# Altium schematic sheet PMIC.SchDoc
size Tabloid; DocumentNumber: 2; SheetNumber: 2; SheetTotal: 13
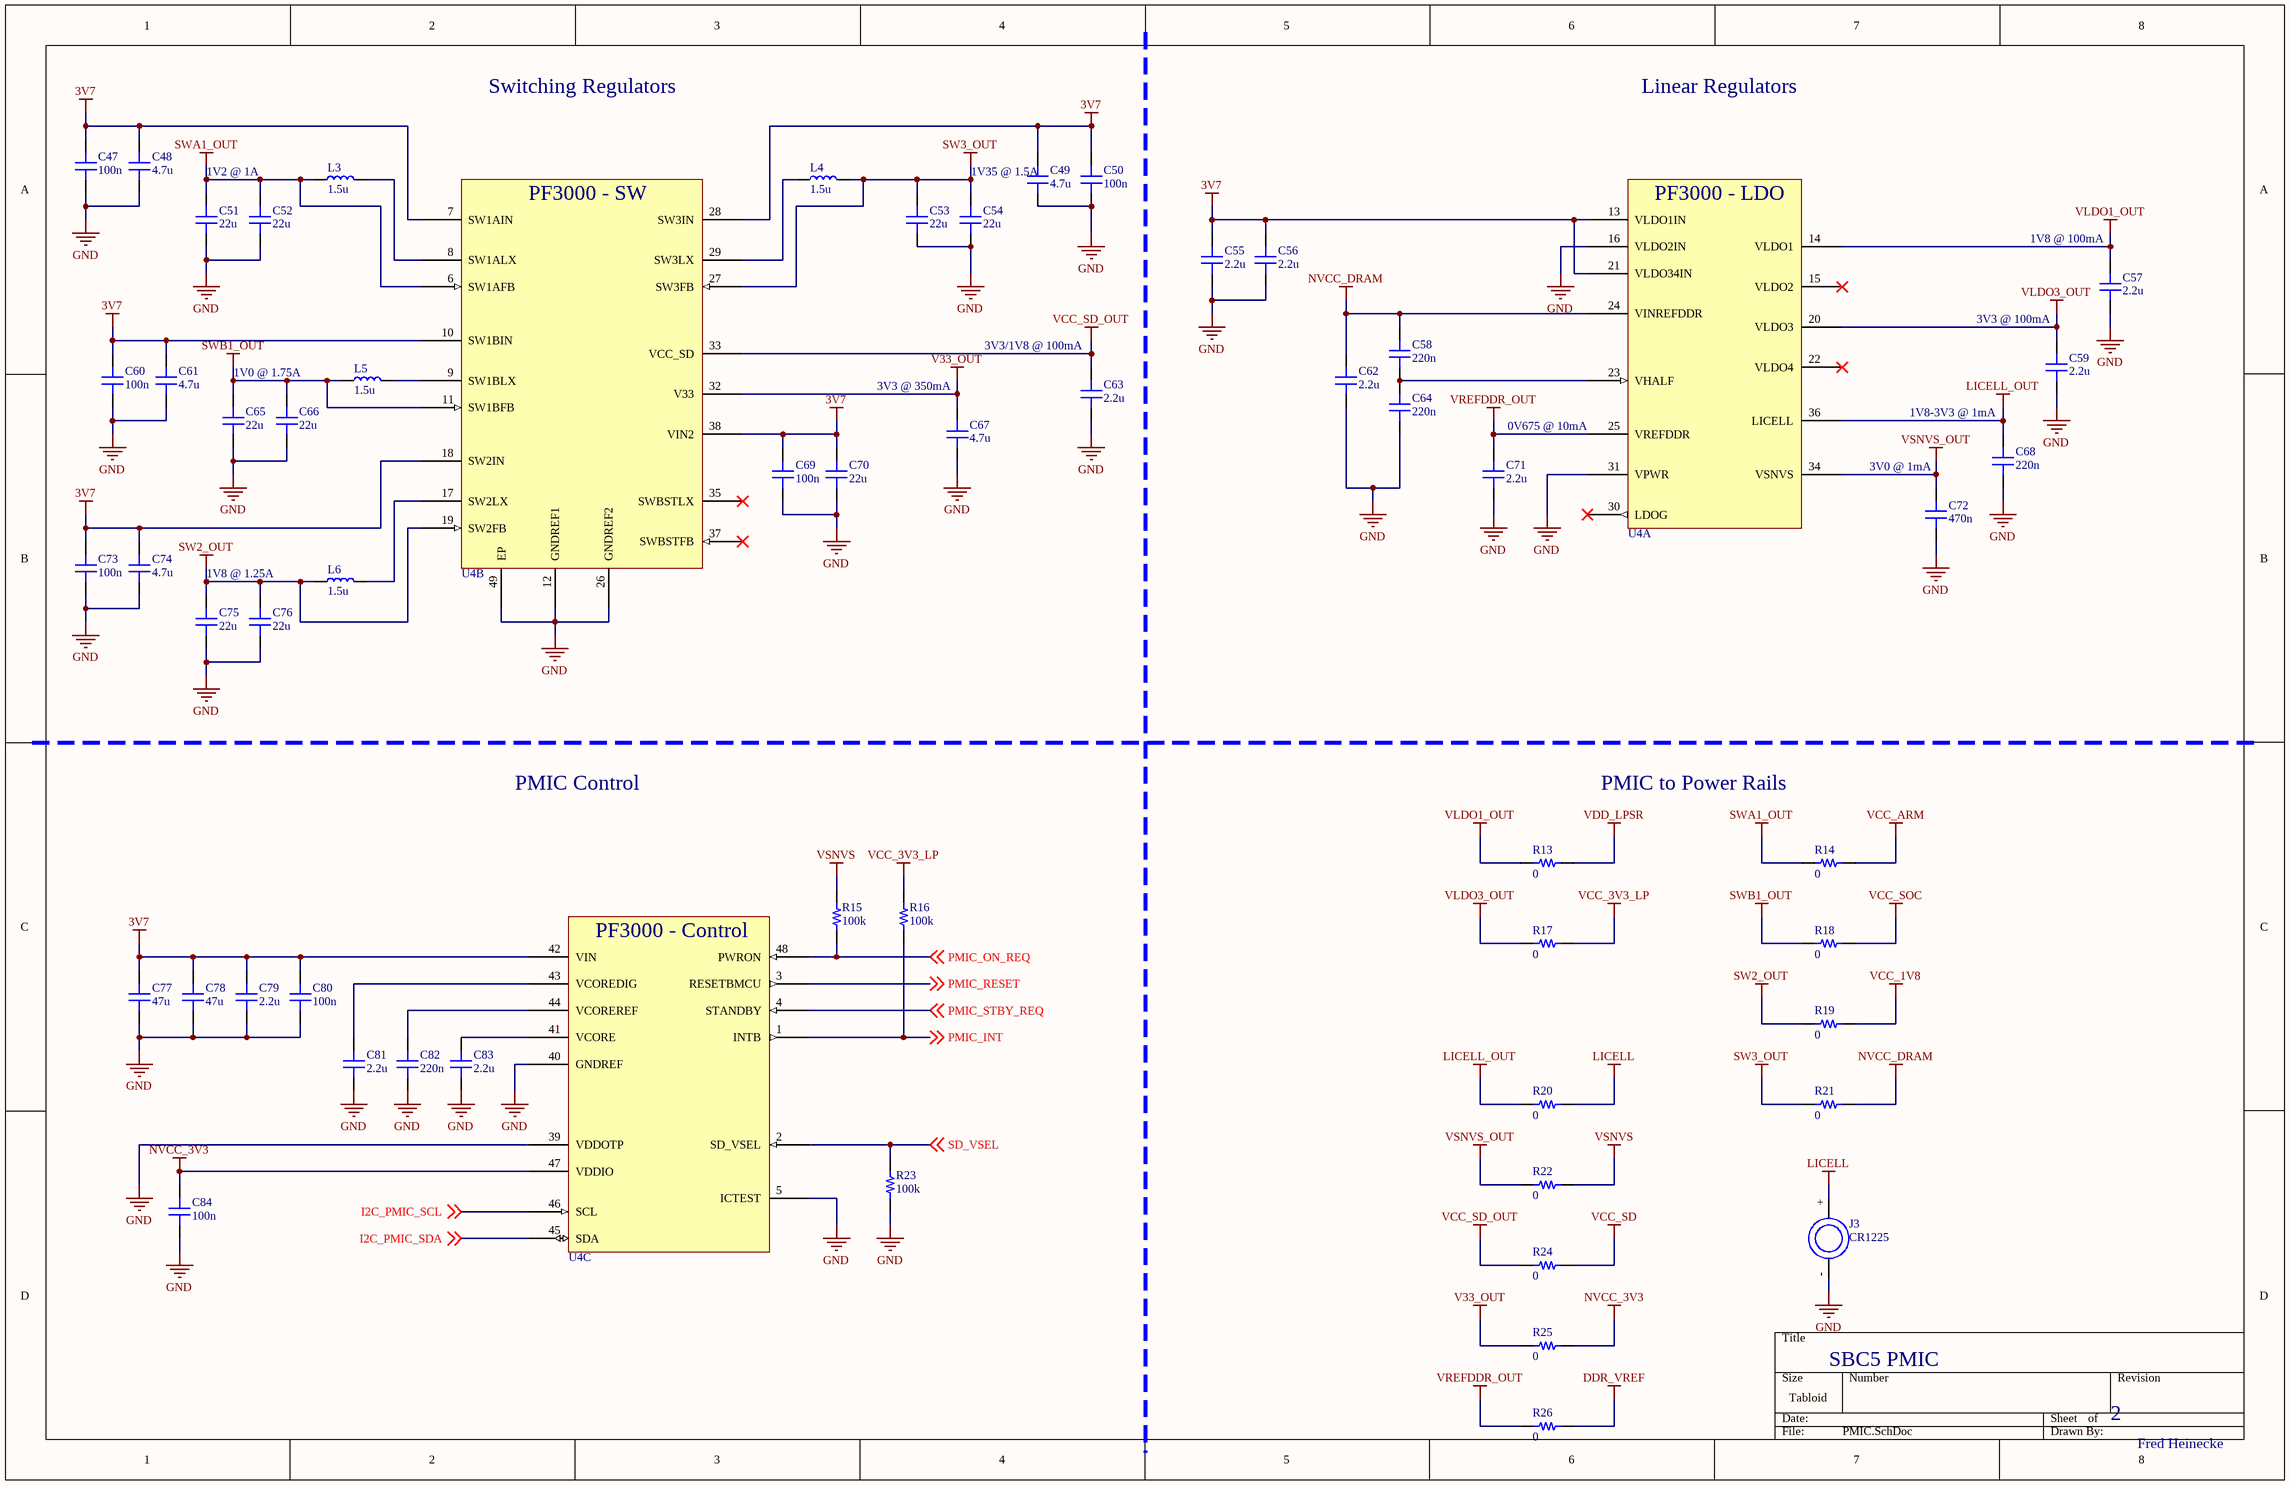
[diagram p0: PMIC.SchDoc]

## Parts
C47  100n  [C0201]
C48  4.7u  [C0603]
C49  4.7u  [C0603]
C50  100n  [C0201]
C51  22u  [C0603]
C52  22u  [C0603]
C53  22u  [C0603]
C54  22u  [C0603]
C55  2.2u  [C0402]
C56  2.2u  [C0402]
C57  2.2u  [C0402]
C58  220n  [C0201]
C59  2.2u  [C0402]
C60  100n  [C0201]
C61  4.7u  [C0603]
C62  2.2u  [C0402]
C63  2.2u  [C0402]
C64  220n  [C0201]
C65  22u  [C0603]
C66  22u  [C0603]
C67  4.7u  [C0603]
C68  220n  [C0201]
C69  100n  [C0201]
C70  22u  [C0603]
C71  2.2u  [C0402]
C72  470n  [C0402]
C73  100n  [C0201]
C74  4.7u  [C0603]
C75  22u  [C0603]
C76  22u  [C0603]
C77  47u  [C0805]
C78  47u  [C0805]
C79  2.2u  [C0402]
C80  100n  [C0201]
C81  2.2u  [C0402]
C82  220n  [C0201]
C83  2.2u  [C0402]
C84  100n  [C0201]
J3  CR1225  [BAT-HLD-012-THM]
L3  1.5u  [L0806]
L4  1.5u  [L0806]
L5  1.5u  [L0806]
L6  1.5u  [L0806]
R13  0  [R0402]
R14  0  [R0402]
R15  100k  [R0201]
R16  100k  [R0201]
R17  0  [R0402]
R18  0  [R0402]
R19  0  [R0402]
R20  0  [R0402]
R21  0  [R0402]
R22  0  [R0402]
R23  100k  [R0201]
R24  0  [R0402]
R25  0  [R0402]
R26  0  [R0402]
U4  PMIC  [PQFN50P700X700X90_HS-49N]  (value not drawn)  (parts A,B,C of 3)

## Nets
3V7: C47.2 C48.2 C49.2 C50.2 C55.2 C56.2 C60.2 C61.2 C69.2 C70.2 C73.2 C74.2 C77.2 C78.2 C79.2 C80.2 U4.7(SW1AIN) U4.10(SW1BIN) U4.13(VLDO1IN) U4.18(SW2IN) U4.21(VLDO34IN) U4.28(SW3IN) U4.38(VIN2) U4.42(VIN)
DDR_VREF: R26.2
GND: C47.1 C48.1 C49.1 C50.1 C51.1 C52.1 C53.1 C54.1 C55.1 C56.1 C57.1 C59.1 C60.1 C61.1 C62.1 C63.1 C64.1 C65.1 C66.1 C67.1 C68.1 C69.1 C70.1 C71.1 C72.1 C73.1 C74.1 C75.1 C76.1 C77.1 C78.1 C79.1 C80.1 C81.1 C82.1 C83.1 C84.1 J3.- R23.1 U4.5(ICTEST) U4.12(GNDREF1) U4.16(VLDO2IN) U4.26(GNDREF2) U4.31(VPWR) U4.39(VDDOTP) U4.40(GNDREF) U4.49(EP)
LICELL: J3.+ R20.2
LICELL_OUT: C68.2 R20.1 U4.36(LICELL)
NVCC_3V3: C84.2 R25.2 U4.47(VDDIO)
NVCC_DRAM: C58.2 C62.2 R21.2 U4.24(VINREFDDR)
SW2_OUT: C75.2 C76.2 L6.1 R19.1 U4.19(SW2FB)
SW3_OUT: C53.2 C54.2 L4.1 R21.1 U4.27(SW3FB)
SWA1_OUT: C51.2 C52.2 L3.1 R14.1 U4.6(SW1AFB)
SWB1_OUT: C65.2 C66.2 L5.1 R18.1 U4.11(SW1BFB)
V33_OUT: C67.2 R25.1 U4.32(V33)
VCC_1V8: R19.2
VCC_3V3_LP: R16.2 R17.2
VCC_ARM: R14.2
VCC_SD: R24.2
VCC_SD_OUT: C63.2 R24.1 U4.33(VCC_SD)
VCC_SOC: R18.2
VDD_LPSR: R13.2
VLDO1_OUT: C57.2 R13.1 U4.14(VLDO1)
VLDO3_OUT: C59.2 R17.1 U4.20(VLDO3)
VREFDDR_OUT: C71.2 R26.1 U4.25(VREFDDR)
VSNVS: R15.2 R22.2
VSNVS_OUT: C72.2 R22.1 U4.34(VSNVS)
I2C_PMIC_SCL: U4.46(SCL) ; off-sheet I2C_PMIC_SCL
I2C_PMIC_SDA: U4.45(SDA) ; off-sheet I2C_PMIC_SDA
PMIC_INT: R16.1 U4.1(INTB) ; off-sheet PMIC_INT
PMIC_ON_REQ: R15.1 U4.48(PWRON) ; off-sheet PMIC_ON_REQ
PMIC_RESET: U4.3(RESETBMCU) ; off-sheet PMIC_RESET
PMIC_STBY_REQ: U4.4(STANDBY) ; off-sheet PMIC_STBY_REQ
SD_VSEL: R23.2 U4.2(SD_VSEL) ; off-sheet SD_VSEL
NetC58_1: C58.1 C64.2 U4.23(VHALF)
NetC81_2: C81.2 U4.43(VCOREDIG)
NetC82_2: C82.2 U4.44(VCOREREF)
NetC83_2: C83.2 U4.41(VCORE)
NetL3_2: L3.2 U4.8(SW1ALX)
NetL4_2: L4.2 U4.29(SW3LX)
NetL5_2: L5.2 U4.9(SW1BLX)
NetL6_2: L6.2 U4.17(SW2LX)

Not connected (* = marked no-connect by the designer): U4 15(VLDO2)* 22(VLDO4)* 30(LDOG)* 35(SWBSTLX)* 37(SWBSTFB)*

## Notes on the sheet
- Switching Regulators
- Linear Regulators
- 1V2 @ 1A
- 1V35 @ 1.5A
- (near C57) 1V8 @ 100mA
- (near C63) 3V3/1V8 @ 100mA
- (near C59) 3V3 @ 100mA
- 1V0 @ 1.75A
- (near C67) 3V3 @ 350mA
- 0V675 @ 10mA
- (near C68) 1V8-3V3 @ 1mA
- (near C72) 3V0 @ 1mA
- 1V8 @ 1.25A
- PMIC Control
- PMIC to Power Rails
- SBC5 PMIC
- 2
- Fred Heinecke
- (in symbol MC34PF3000A4EP, part A) PF3000 - LDO
- (in symbol MC34PF3000A4EP, part B) PF3000 - SW
- (in symbol MC34PF3000A4EP, part C) PF3000 - Control

## Library data of the parts
C47 C50 C60 C69 C73 C80 C84 = GRM033R61C104KE84D: Multilayer Ceramic Capacitors MLCC - SMD/SMT 0201 0.10uF 16volts *Derate Voltage/Temp; Manufacturer: Murata; Capacitance: 100nF; Dielectric: X5R; Voltage Rating: 16V; Tolerance: 10%; Supplier 1: Digi-Key; Supplier Part Number 1: 490-9985-2-ND; Manufacturer Part Number: GRM033R61C104KE84D; RoHS: Yes; Category: Ceramic Capacitors; Stock 1: 2025000; Pricing 1: 15000=0.00770, 30000=0.00732 (USD); Mount: Surface Mount; Case/Package: 0201; Case Code (Metric): 0603; Case Code (Imperial): 0201; Weight: 1.2E-05oz; Min Operating Temperature: -55°C; Max Operating Temperature: 85°C; Packaging: Tape and Reel; Termination: SMD/SMT; Voltage Rating (DC): 16V; Package Quantity: 15000; Length: 0.6mm; Width: 0.012inch; Height: 0.3mm; Thickness: 0.013inch; REACH SVHC: No SVHC; Lead Free: Lead Free; RoHS Compliant: Yes; ComponentLink1URL: http://www.farnell.com/datasheets/2867836.pdf?src-supplier=Farnell; ComponentLink1Description: http://www.farnell.com/datasheets/2867836.pdf?src-supplier=Farnell; ComponentLink2URL: http://components.arrow.com/part/dataview/0323_07280039?src-supplier=Arrow+Europe; ComponentLink2Description: http://components.arrow.com/part/dataview/0323_07280039?src-supplier=Arrow+Europe; ComponentLink3URL: http://www.mouser.com/ds/2/281/c02e-2905.pdf?src-supplier=Mouser; ComponentLink3Description: http://www.mouser.com/ds/2/281/c02e-2905.pdf?src-supplier=Mouser; ComponentLink4URL: http://search.murata.co.jp/Ceramy/image/img/A01X/G101/ENG/GRM033R61C104KE84-01.pdf?src-supplier=Digi-Key; ComponentLink4Description: http://search.murata.co.jp/Ceramy/image/img/A01X/G101/ENG/GRM033R61C104KE84-01.pdf?src-supplier=Digi-Key; ComponentLink5URL: http://psearch.en.murata.com/capacitor/product/GRM033R61C104KE84%23.pdf?src-supplier=Avnet; ComponentLink5Description: http://psearch.en.murata.com/capacitor/product/GRM033R61C104KE84%23.pdf?src-supplier=Avnet; ComponentLink6URL: http://www.farnell.com/datasheets/2867836.pdf?src-supplier=Element14; ComponentLink6Description: http://www.farnell.com/datasheets/2867836.pdf?src-supplier=Element14
C48 C49 C61 C67 C74 = CL10A475KP8NNNC: Cap Ceramic 4.7uF 10V X5R 10% Pad SMD 0603 85C T/R; Manufacturer: Samsung; Supplier 1: Digi-Key; Supplier Part Number 1: 1276-1044-1-ND; Manufacturer Part Number: CL10A475KP8NNNC; RoHS: Yes; Category: Ceramic Capacitors; Stock 1: 3477192; Pricing 1: 1=0.10000, 10=0.04700, 50=0.02560, 100=0.02090, 500=0.01490, 1000=0.01171 (USD); Mount: Surface Mount; Case/Package: 0603; Case Code (Metric): 1608; Case Code (Imperial): 0603; Contact Plating: Tin; Min Operating Temperature: -55°C; Max Operating Temperature: 85°C; Tolerance: 10%; Capacitance: 4.7uF; Dielectric: X5R; Package Quantity: 1; Packaging: Tape and Reel; Voltage Rating: 10V; Series: CL; Construction: Flat; Length: 1.6mm; Width: 0.031inch; Height: 0.8mm; Thickness: 0.035inch; Depth: 0.8mm; Radiation Hardening: No; RoHS Compliant: Yes; ComponentLink1URL: https://datasheet.ciiva.com/25797/cl10a475kp8nnnc-25797520.pdf?src-supplier=Digi-Key; ComponentLink1Description: https://datasheet.ciiva.com/25797/cl10a475kp8nnnc-25797520.pdf?src-supplier=Digi-Key; ComponentLink2URL: https://datasheet.ciiva.com/26838/getdatasheetpartid-358676-26838384.pdf?src-supplier=Verical; ComponentLink2Description: https://datasheet.ciiva.com/26838/getdatasheetpartid-358676-26838384.pdf?src-supplier=Verical; ComponentLink3URL: https://datasheet.ciiva.com/16318/cl05b104kq5nnnc-16318245.pdf?src-supplier=Future+Electronics; ComponentLink3Description: https://datasheet.ciiva.com/16318/cl05b104kq5nnnc-16318245.pdf?src-supplier=Future+Electronics
C51-C54 C65 C66 C70 C75 C76 = GRM188R61A226ME15D: 0603 22 uF 10 V ±20% Tolerance X5R Multilayer Ceramic Chip Capacitor; Manufacturer: Murata; Capacitance: 22uF; Voltage Rating: 10V; Supplier 1: Digi-Key; Manufacturer Part Number: GRM188R61A226ME15D; RoHS: Yes; Category: Ceramic Capacitors; Stock 1: 1418007; Pricing 1: 1=0.30000, 10=0.20500, 50=0.13680, 100=0.11630, 500=0.08210, 1000=0.07184 (USD); Mount: Surface Mount; Case/Package: 0603; Case Code (Metric): 1608; Case Code (Imperial): 0603; Material: Ceramic; Weight: 0.000222oz; Min Operating Temperature: -55°C; Max Operating Temperature: 85°C; Tolerance: 20%; Packaging: Tape and Reel; Dielectric: X5R; Termination: SMD/SMT; Voltage Rating (DC): 10V; Package Quantity: 4000; Length: 1.6mm; Width: 0.8mm; Height: 0.8mm; Thickness: 0.039inch; Depth: 0.8mm; REACH SVHC: No SVHC; Lead Free: Lead Free; ComponentLink1URL: https://datasheet.ciiva.com/46444/1769893-46444975.pdf?src-supplier=Element14; ComponentLink1Description: https://datasheet.ciiva.com/46444/1769893-46444975.pdf?src-supplier=Element14; Supplier Part Number 1: 490-10476-1-ND
C55-C57 C59 C62 C63 C71 C79 C81 C83 = LMK105BJ225MV-F: TAIYO YUDEN         LMK105BJ225MV-F            CERAMIC CAPACITOR, 2.2UF, 10V, X5R, 20%, 0402; Supplier 1: Digi-Key; Manufacturer: Taiyo Yuden; Manufacturer Part Number: LMK105BJ225MV-F; RoHS: Yes; Category: Ceramic Capacitors; Stock 1: 422093; Pricing 1: 1=0.10000, 10=0.05800, 50=0.03160, 100=0.02590, 500=0.01848, 1000=0.01452, 2500=0.01320, 5000=0.01214 (USD); Mount: Surface Mount; Case/Package: 0402; Case Code (Imperial): 0402; Case Code (Metric): 1005; Min Operating Temperature: -55°C; Max Operating Temperature: 85°C; Termination: SMD/SMT; Packaging: Tape and Reel; Capacitance: 2.2uF; Tolerance: 20%; Voltage Rating: 10V; Package Quantity: 1; Voltage Rating (DC): 10V; Dielectric: X5R; Resistor Type: Ceramic; Length: 1mm; Width: 0.5mm; Height: 0.5mm; Thickness: 0.022inch; Depth: 0.5mm; Radiation Hardening: No; Halogen Free: Halogen Free; REACH SVHC: Unknown; ComponentLink1URL: https://datasheet.ciiva.com/30190/500lmk105bj225mv-f-30190498.pdf?src-supplier=Onlinecomponents.com; ComponentLink1Description: https://datasheet.ciiva.com/30190/500lmk105bj225mv-f-30190498.pdf?src-supplier=Onlinecomponents.com; ComponentLink2URL: https://datasheet.ciiva.com/23631/lmk105bj225mv-f-ss-23631491.pdf?src-supplier=Newark; ComponentLink2Description: https://datasheet.ciiva.com/23631/lmk105bj225mv-f-ss-23631491.pdf?src-supplier=Newark; ComponentLink3URL: https://datasheet.ciiva.com/134/lmk105bj225mv-f-ss-134677.pdf?src-supplier=Digi-Key; ComponentLink3Description: https://datasheet.ciiva.com/134/lmk105bj225mv-f-ss-134677.pdf?src-supplier=Digi-Key; ComponentLink4URL: https://datasheet.ciiva.com/15921/286lmk105bj225mv-f-15921222.pdf?src-supplier=Onlinecomponents.com; ComponentLink4Description: https://datasheet.ciiva.com/15921/286lmk105bj225mv-f-15921222.pdf?src-supplier=Onlinecomponents.com; Supplier Part Number 1: 587-3153-1-ND
C58 C64 C68 C82 = GRM033R61C224KE14D: Cap Ceramic Monolithic 0.22uF 16VDC 10% SMD Paper T/R; Manufacturer: Murata; Supplier 1: Digi-Key; Manufacturer Part Number: GRM033R61C224KE14D; RoHS: No; Stock 1: 16192; Pricing 1: 1=0.10000, 10=0.03900, 50=0.02120, 100=0.01720, 500=0.01232, 1000=0.00968, 2500=0.00880, 5000=0.00810 (USD); ComponentLink1URL: https://search.murata.co.jp/Ceramy/image/img/A01X/G101/ENG/GRM033R61C224KE14-01.pdf?src-supplier=Digi-Key; ComponentLink1Description: https://search.murata.co.jp/Ceramy/image/img/A01X/G101/ENG/GRM033R61C224KE14-01.pdf?src-supplier=Digi-Key; Supplier Part Number 1: 490-17040-1-ND
C72 = CL05A474KP5NNNC: Cap Ceramic 0.47uF 10V X5R 10% SMD 0402 85C T/R; Manufacturer: Samsung; Capacitance: 470nF; Supplier 1: Digi-Key; Supplier Part Number 1: 1276-1173-1-ND; Manufacturer Part Number: CL05A474KP5NNNC; RoHS: Yes; Category: Ceramic Capacitors; Stock 1: 1598783; Pricing 1: 1=0.10000, 10=0.06000, 50=0.03260, 100=0.02670, 500=0.01906, 1000=0.01497, 2500=0.01361, 5000=0.01252 (USD); Mount: Surface Mount; Case/Package: 0402; Case Code (Metric): 1005; Case Code (Imperial): 0402; Min Operating Temperature: -55°C; Max Operating Temperature: 85°C; Tolerance: 10%; Dielectric: X5R; Packaging: Tape and Reel; Voltage Rating: 10V; Voltage Rating (DC): 10V; Series: CL; Construction: Flat; Length: 1mm; Width: 0.02inch; Height: 0.5mm; Thickness: 0.022inch; Depth: 0.5mm; Radiation Hardening: No; Lead Free: Lead Free; RoHS Compliant: Yes; ComponentLink1URL: https://datasheet.ciiva.com/25710/cl05a474kp5nnnc-25710324.pdf?src-supplier=Digi-Key; ComponentLink1Description: https://datasheet.ciiva.com/25710/cl05a474kp5nnnc-25710324.pdf?src-supplier=Digi-Key; ComponentLink2URL: https://datasheet.ciiva.com/26838/getdatasheetpartid-355286-26838191.pdf?src-supplier=Verical; ComponentLink2Description: https://datasheet.ciiva.com/26838/getdatasheetpartid-355286-26838191.pdf?src-supplier=Verical; ComponentLink3URL: https://datasheet.ciiva.com/16437/cl05b104kq5nnnc-16437351.pdf?src-supplier=Future+Electronics; ComponentLink3Description: https://datasheet.ciiva.com/16437/cl05b104kq5nnnc-16437351.pdf?src-supplier=Future+Electronics
C77 C78 = C2012X5R1A476M125AC: TDK   C2012X5R1A476M125AC   SMD Multilayer Ceramic Capacitor, C Series, 47 F,  20%, X5R, 10 V, 0805 [2012 Metric]; Capacitance: 47uF; Voltage Rating: 10V; Supplier 1: Digi-Key; Supplier Part Number 1: 445-8239-1-ND; Manufacturer: TDK; Manufacturer Part Number: C2012X5R1A476M125AC; RoHS: Yes; Category: Ceramic Capacitors; Stock 1: 147108; Pricing 1: 1=0.85000, 10=0.64400, 50=0.53460, 100=0.46040, 500=0.35640, 1000=0.30690 (USD); Mount: Surface Mount; Case/Package: 0805; Case Code (Metric): 2012; Case Code (Imperial): 0805; Dielectric Material: Ceramic; Weight: 0.000194oz; Min Operating Temperature: -55°C; Max Operating Temperature: 85°C; Tolerance: 20%; Packaging: Tape and Reel; Voltage Rating (DC): 10V; Dielectric: X5R; Termination: SMD/SMT; Package Quantity: 1; Resistor Type: Ceramic; Voltage: 10V; Series: C; Length: 2mm; Width: 0.049inch; Height: 1.25mm; Depth: 1.25mm; Thickness: 0.057inch; REACH SVHC: No SVHC; Lead Free: Lead Free; RoHS Compliant: Yes; ComponentLink1URL: https://datasheet.ciiva.com/24216/c2012x5r1a476m125ac-264921-24216523.pdf?src-supplier=Mouser; ComponentLink1Description: https://datasheet.ciiva.com/24216/c2012x5r1a476m125ac-264921-24216523.pdf?src-supplier=Mouser; ComponentLink2URL: https://datasheet.ciiva.com/24191/c2012x5r1a476m125ac-24191773.pdf?src-supplier=Future+Electronics; ComponentLink2Description: https://datasheet.ciiva.com/24191/c2012x5r1a476m125ac-24191773.pdf?src-supplier=Future+Electronics; ComponentLink3URL: https://datasheet.ciiva.com/6259/tdkmlcccaprange-6259575.pdf?src-supplier=Digi-Key; ComponentLink3Description: https://datasheet.ciiva.com/6259/tdkmlcccaprange-6259575.pdf?src-supplier=Digi-Key; ComponentLink4URL: https://datasheet.ciiva.com/6259/tdkmlcccaprange-6259576.pdf?src-supplier=Digi-Key; ComponentLink4Description: https://datasheet.ciiva.com/6259/tdkmlcccaprange-6259576.pdf?src-supplier=Digi-Key; ComponentLink5URL: https://datasheet.ciiva.com/6259/tdkmlcccaprange-6259577.pdf?src-supplier=Digi-Key; ComponentLink5Description: https://datasheet.ciiva.com/6259/tdkmlcccaprange-6259577.pdf?src-supplier=Digi-Key; ComponentLink6URL: https://datasheet.ciiva.com/7975/1796654-7975085.pdf?src-supplier=Element14; ComponentLink6Description: https://datasheet.ciiva.com/7975/1796654-7975085.pdf?src-supplier=Element14; ComponentLink7URL: https://datasheet.ciiva.com/22694/1796654-22694142.pdf?src-supplier=Element14; ComponentLink7Description: https://datasheet.ciiva.com/22694/1796654-22694142.pdf?src-supplier=Element14
J3 = BAT-HLD-012-THM: BATTERY RETAINER COIN PC PIN; Manufacturer: Linx; Number of Cells: 1; Supplier 1: Digi-Key; Supplier Part Number 1: BAT-HLD-012-THM-ND; Manufacturer Part Number: BAT-HLD-012-THM; RoHS: Yes; Category: Uncategorized; Stock 1: 1284; Pricing 1: 1=0.29000, 10=0.27800, 25=0.26600, 100=0.24100, 250=0.23000, 500=0.21900, 1000=0.19600, 2000=0.18000, 5000=0.17765 (USD); Mount: Through Hole,PCB; Termination: PC Pin; Package Quantity: 1000; Number of Batteries: 1; Lead Free: Lead Free; ComponentLink1URL: https://datasheet.ciiva.com/4/bat-hld-012-thm-4039.pdf?src-supplier=Digi-Key; ComponentLink1Description: https://datasheet.ciiva.com/4/bat-hld-012-thm-4039.pdf?src-supplier=Digi-Key; ComponentLink2URL: https://datasheet.ciiva.com/4642/bat-hld-012-thm20diagram-201689-4642575.pdf?src-supplier=Mouser; ComponentLink2Description: https://datasheet.ciiva.com/4642/bat-hld-012-thm20diagram-201689-4642575.pdf?src-supplier=Mouser
L3-L6 = DFE201610E-1R5M=P2: Inductor Power Shielded Wirewound 1.5uH 20% 1MHz Metal 2.1A 0.091Ohm DCR 0806 T/R; Manufacturer: Murata; Supplier 1: Digi-Key; Supplier Part Number 1: 490-18107-1-ND; Manufacturer Part Number: DFE201610E-1R5M=P2; RoHS: Yes; Category: Fixed Inductors; Stock 1: 1449; Pricing 1: 1=0.42000, 10=0.36800, 25=0.34120, 50=0.28880, 100=0.26250, 250=0.24676, 500=0.22050, 1000=0.17850 (USD); RoHS Compliant: Yes
R13 R14 R17-R22 R24-R26 = RMCF0402ZT0R00: RES 0 OHM JUMPER 1/16W 0402; Manufacturer: Stackpole Electronics; Resistance: 0R; Power Rating: 63mW; Current Rating: 1A; Working Voltage: 50V; Supplier 1: Digi-Key; Supplier Part Number 1: RMCF0402ZT0R00CT-ND; Manufacturer Part Number: RMCF0402ZT0R00; RoHS: Yes; Category: Chip SMD Resistors; Stock 1: 7645981; Pricing 1: 1=0.10000, 10=0.01000, 25=0.00720, 50=0.00560, 100=0.00410, 250=0.00316, 500=0.00252, 1000=0.00186, 5000=0.00133 (USD); Mount: Surface Mount; Case/Package: 0402; Case Code (Metric): 1005; Case Code (Imperial): 0402; Contact Plating: Tin,Matte; Min Operating Temperature: -55°C; Max Operating Temperature: 155°C; Packaging: Tape and Reel; Resistor Type: Thick Film; Number of Terminations: 2; Max Power Dissipation: 63mW; Features: Automotive AEC-Q200; Series: RMCF; Technology: THICK FILM; Construction: Rectangular; Length: 0.039inch; Width: 0.02inch; Height: 0.016inch; Depth: 0.5mm; Radiation Hardening: No; Military Standard: Not; Lead Free: Lead Free; RoHS Compliant: Yes; ComponentLink1URL: https://datasheet.ciiva.com/26835/getdatasheetpartid-409751-26835612.pdf?src-supplier=Verical; ComponentLink1Description: https://datasheet.ciiva.com/26835/getdatasheetpartid-409751-26835612.pdf?src-supplier=Verical
R15 R16 R23 = ERJ-1GNF1003C: PANASONIC - ERJ1GNF1003C - RES, 100K, 1%, 0.05W, 0201, THICK FILM; Resistance: 100kR; Temperature Coefficient: 200ppm/°C; Power Rating: 50mW; Voltage Rating: 25V; Supplier 1: Digi-Key; Supplier Part Number 1: P122655CT-ND; Manufacturer: Panasonic; Manufacturer Part Number: ERJ-1GNF1003C; RoHS: Yes; Category: Chip SMD Resistors; Stock 1: 833904; Pricing 1: 1=0.10000, 10=0.04600, 100=0.01890, 1000=0.00848, 2500=0.00736, 5000=0.00608 (USD); Mount: Surface Mount; Case/Package: 0201; Number of Pins: 2; Contact Plating: Tin,Matte; Case Code (Metric): 0603; Case Code (Imperial): 0201; Weight: 6E-06oz; Size Code: 0201; Min Operating Temperature: -55°C; Max Operating Temperature: 125°C; Tolerance: 1%; Resistor Type: Thick Film; Packaging: Tape and Reel; Package Quantity: 15000; Number of Terminations: 2; Max Power Dissipation: 50mW; Termination: SMD/SMT; Voltage Rating (DC): 25V; Series: ERJ; Resistance Tolerance: 1%; Length: 0.024inch; Width: 0.012inch; Height: 0.01inch; Radiation Hardening: No; REACH SVHC: No SVHC; Lead Free: Lead Free; RoHS Compliant: Yes; ComponentLink1URL: https://datasheet.ciiva.com/7830/1678782-7830709.pdf?src-supplier=Element14; ComponentLink1Description: https://datasheet.ciiva.com/7830/1678782-7830709.pdf?src-supplier=Element14; ComponentLink2URL: https://datasheet.ciiva.com/16508/aoa0000ce2-16508328.pdf?src-supplier=Future+Electronics; ComponentLink2Description: https://datasheet.ciiva.com/16508/aoa0000ce2-16508328.pdf?src-supplier=Future+Electronics; ComponentLink3URL: https://datasheet.ciiva.com/24161/aoa0000ce2-24161032.pdf?src-supplier=Mouser; ComponentLink3Description: https://datasheet.ciiva.com/24161/aoa0000ce2-24161032.pdf?src-supplier=Mouser; ComponentLink4URL: https://datasheet.ciiva.com/43467/1678782-43467102.pdf?src-supplier=Farnell; ComponentLink4Description: https://datasheet.ciiva.com/43467/1678782-43467102.pdf?src-supplier=Farnell
U4 = MC34PF3000A4EP: Power Management IC, i.MX7, pre-prog, 4 buck, 6 LDO, 1 boost, QFN 48, Tray; Manufacturer: NXP Freescale; Manufacturer Part Number: MC34PF3000A1EP; Stock 1: 360; Pricing 1: 1=5.6, 10=5.027, 100=4.119, 500=3.50642, 1000=2.95722 (USD); Mount: Surface Mount; Case/Package: QFN; Min Operating Temperature: -40°C; Max Operating Temperature: 105°C; Packaging: Tray; ComponentLink1Description: Datasheet; ComponentLink1URL: https://www.nxp.com/docs/en/data-sheet/PF3000.pdf; Supplier 1: Digi-Key; Supplier Part Number 1: MC34PF3000A4EP-ND